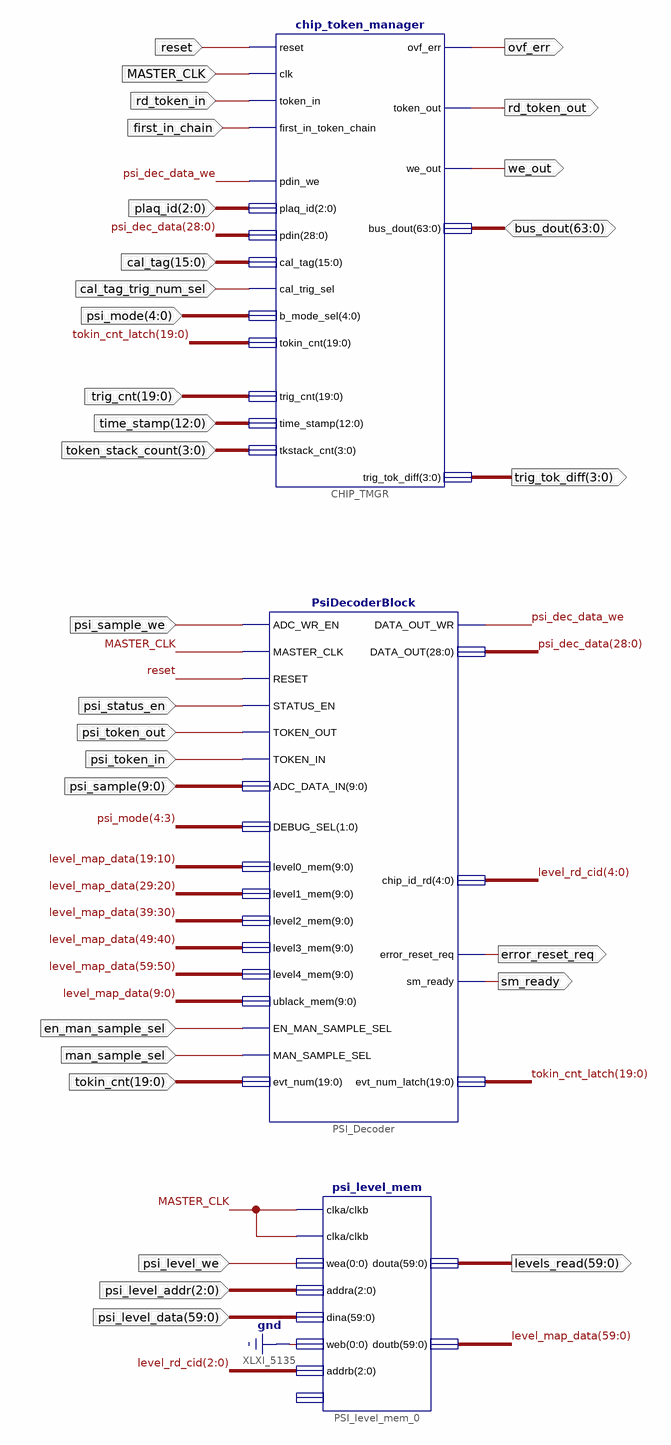
[diagram p0: schematic sheet 1]
// Xilinx ISE schematic PSI_Block.sch (virtex4) as structural Verilog: 3 symbols, 30 ports
module PSI_Block (
  input  reset,
  input  MASTER_CLK,
  input  rd_token_in,
  input  [2:0] plaq_id,
  input  [15:0] cal_tag,
  input  first_in_chain,
  input  cal_tag_trig_num_sel,
  input  [4:0] psi_mode,
  input  [19:0] trig_cnt,
  input  [9:0] psi_sample,
  input  psi_sample_we,
  input  psi_status_en,
  input  psi_token_out,
  input  en_man_sample_sel,
  input  man_sample_sel,
  input  psi_level_we,
  input  [2:0] psi_level_addr,
  input  [59:0] psi_level_data,
  input  psi_token_in,
  input  [19:0] tokin_cnt,
  input  [12:0] time_stamp,
  input  [3:0] token_stack_count,
  inout  [63:0] bus_dout,
  output ovf_err,
  output rd_token_out,
  output we_out,
  output [59:0] levels_read,
  output error_reset_req,
  output sm_ready,
  output [3:0] trig_tok_diff
);

  wire psi_dec_data_we;
  wire [4:0] level_rd_cid;
  wire [19:0] tokin_cnt_latch;
  wire [28:0] psi_dec_data;
  wire [59:0] level_map_data;

  chip_token_manager CHIP_TMGR (
    .reset(reset), .clk(MASTER_CLK), .token_in(rd_token_in), .first_in_token_chain(first_in_chain),
    .cal_trig_sel(cal_tag_trig_num_sel), .pdin_we(psi_dec_data_we), .plaq_id(plaq_id), .cal_tag(cal_tag),
    .tokin_cnt(tokin_cnt_latch), .trig_cnt(trig_cnt), .time_stamp(time_stamp),
    .tkstack_cnt(token_stack_count), .pdin(psi_dec_data), .b_mode_sel(psi_mode), .bus_dout(bus_dout),
    .ovf_err(ovf_err), .token_out(rd_token_out), .we_out(we_out), .trig_tok_diff(trig_tok_diff));
  PsiDecoderBlock PSI_Decoder (
    .ADC_WR_EN(psi_sample_we), .EN_MAN_SAMPLE_SEL(en_man_sample_sel), .MAN_SAMPLE_SEL(man_sample_sel),
    .MASTER_CLK(MASTER_CLK), .RESET(reset), .STATUS_EN(psi_status_en), .TOKEN_IN(psi_token_in),
    .TOKEN_OUT(psi_token_out), .ADC_DATA_IN(psi_sample), .DEBUG_SEL(psi_mode[4:3]), .evt_num(tokin_cnt),
    .level0_mem(level_map_data[19:10]), .level1_mem(level_map_data[29:20]),
    .level2_mem(level_map_data[39:30]), .level3_mem(level_map_data[49:40]),
    .level4_mem(level_map_data[59:50]), .ublack_mem(level_map_data[9:0]), .DATA_OUT_WR(psi_dec_data_we),
    .error_reset_req(error_reset_req), .sm_ready(sm_ready), .DATA_OUT(psi_dec_data),
    .chip_id_rd(level_rd_cid), .evt_num_latch(tokin_cnt_latch));
  psi_level_mem PSI_level_mem_0 (
    .clka(MASTER_CLK), .clkb(MASTER_CLK), .wea(psi_level_we), .addra(psi_level_addr), .dina(psi_level_data),
    .addrb(level_rd_cid[2:0]), .web(1'b0), .doutb(level_map_data), .douta(levels_read));  // open: dinb
endmodule
